# EAGLE schematic board (EAGLE 7.6.0)
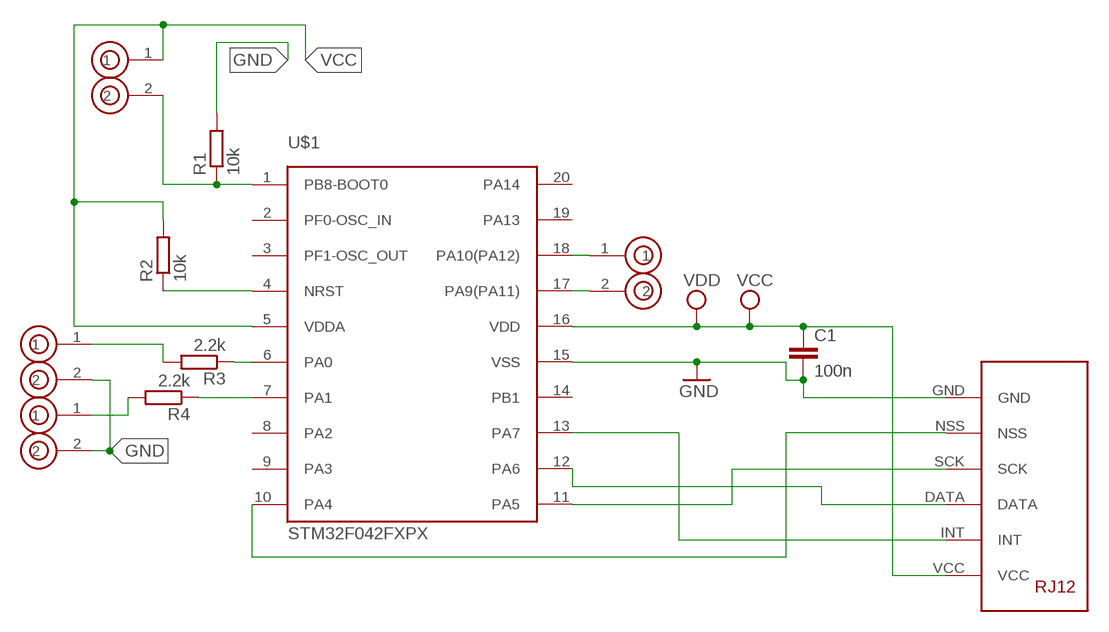
[diagram p0: schematic, sheet 1]

## Parts
C1  100n  C-EUC1206K  [C1206K]
R1  10k  R-EU_R0805  [R0805]
R2  10k  R-EU_R0805  [R0805]
R3  2.2k  R-EU_R0805  [R0805]
R4  2.2k  R-EU_R0805  [R0805]
U$1  STM32F042FXPX  [TSSOP20]
U$2  RJ12SMD  [RJ12_SMD]
U$3  GOLDPIN_2  [GOLDPIN_2_SMD]
U$4  GOLDPIN_2  [GOLDPIN_2_SMD]
U$5  GOLDPIN_2  [GOLDPIN_2_SMD]
U$6  GOLDPIN_2  [GOLDPIN_2_SMD]

## Nets
GND: C1.2 R1.2 U$1.15(VSS) U$2.GND U$5.2 U$6.2
N$2: U$1.18(PA10(PA12)) U$3.1
N$3: U$1.17(PA9(PA11)) U$3.2
N$4: R2.1 U$1.4(NRST)
N$5: R1.1 U$1.1(PB8-BOOT0) U$4.2
N$6: R3.1 U$1.6(PA0)
N$7: R4.1 U$1.7(PA1)
N$8: R3.2 U$5.1
N$10: U$1.11(PA5) U$2.SCK
N$11: U$1.13(PA7) U$2.INT
N$12: U$1.10(PA4) U$2.NSS
N$13: R4.2 U$6.1
N$16: U$1.12(PA6) U$2.DATA
VCC: C1.1 R2.2 U$1.5(VDDA) U$1.16(VDD) U$2.VCC U$4.1 ; supply symbol labelled VDD
Unconnected: U$1.2(PF0-OSC_IN) U$1.3(PF1-OSC_OUT) U$1.8(PA2) U$1.9(PA3) U$1.14(PB1) U$1.19(PA13) U$1.20(PA14)

## Library data of the parts
C1 = resistor:C-EU: CAPACITOR, European symbol
R1-R4 = resistor:R-EU_: RESISTOR, European symbol
U$1 = stm32f0:STM32F042FXPX
U$2 = gumyns:RJ12
U$3-U$6 = gumyns:GOLDPIN_2